# EAGLE design scheda_trasduttori_v2 (EAGLE 6.5.0)

## Sheet 1 of 4
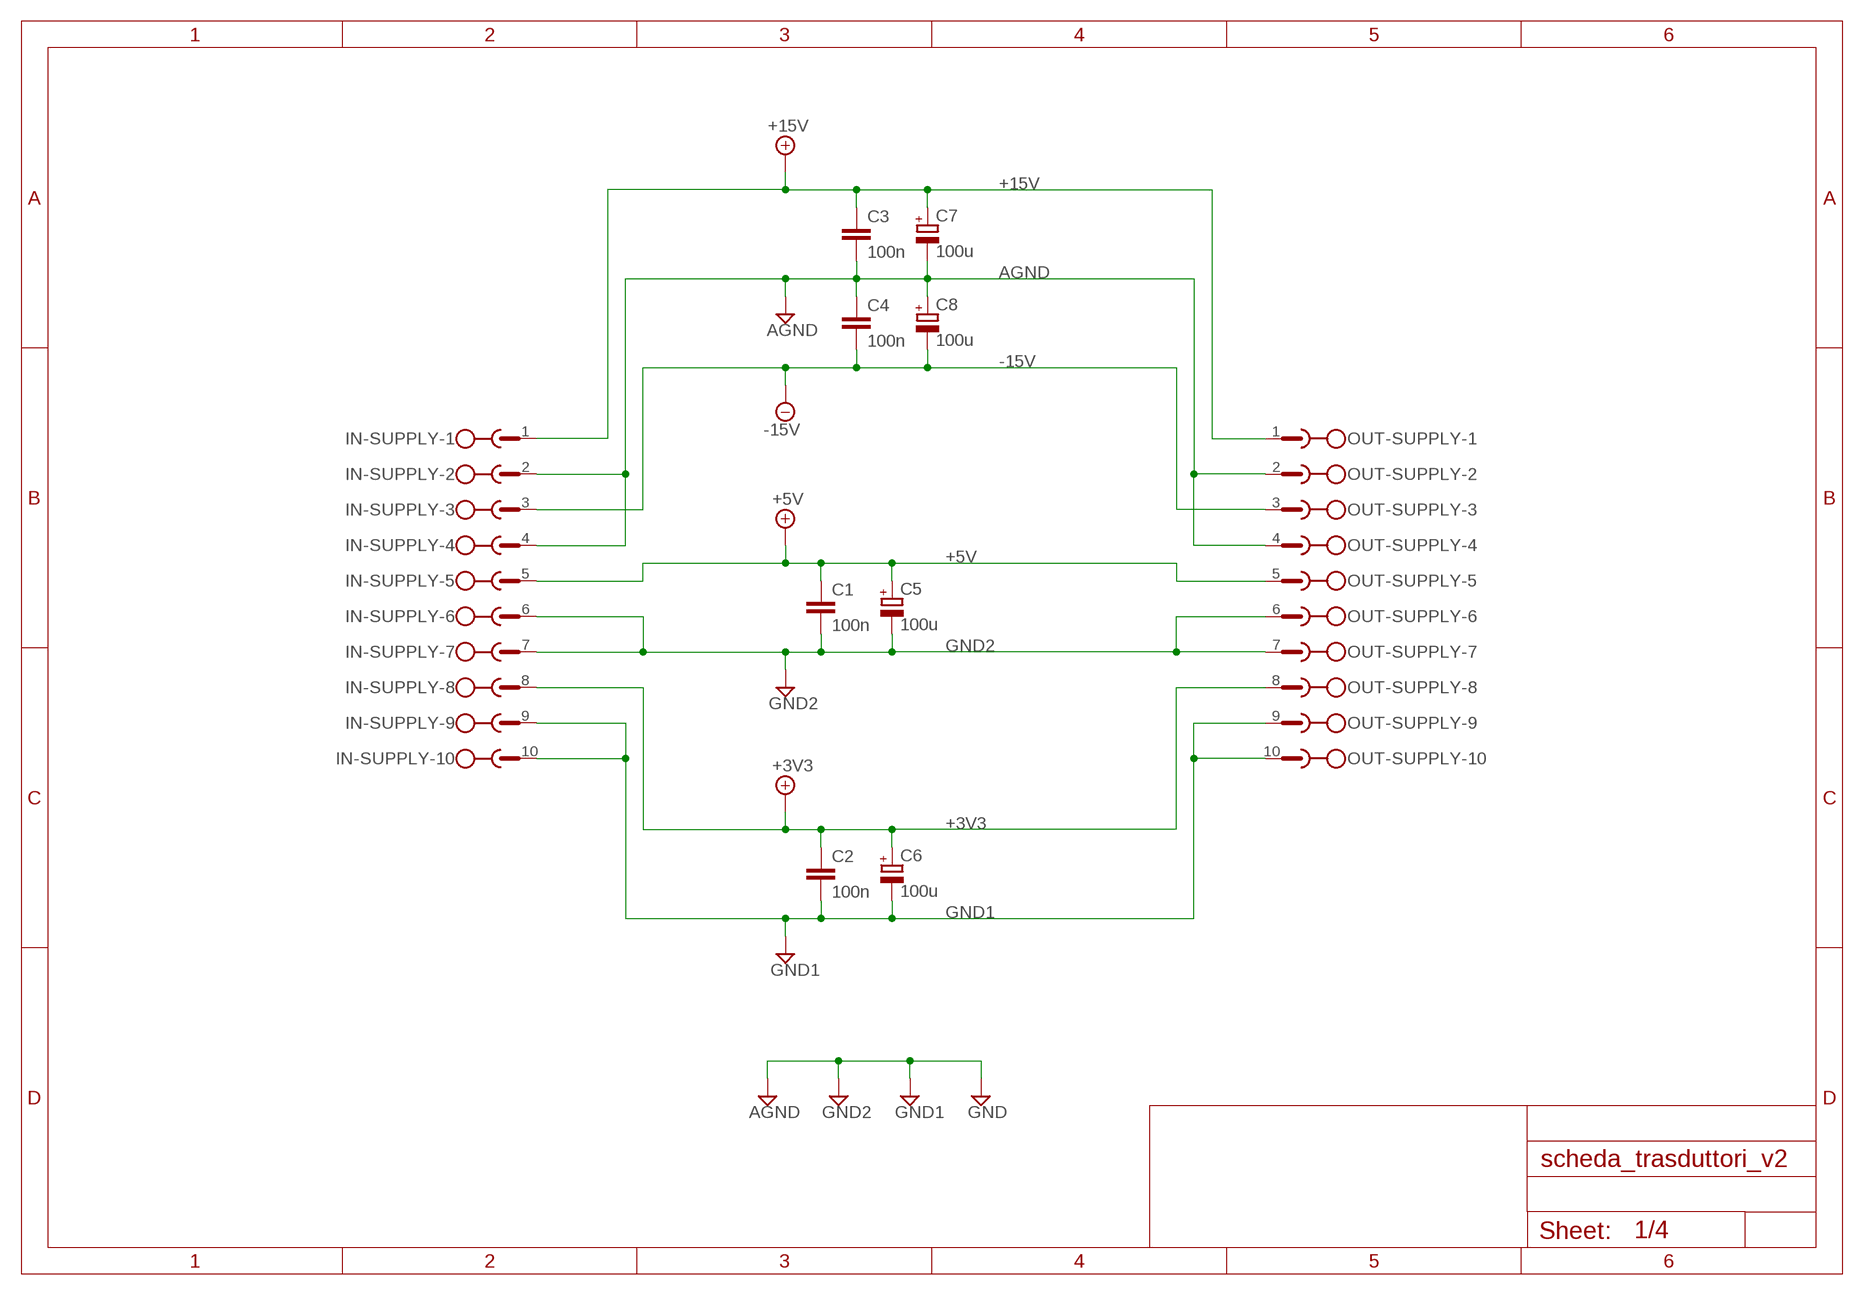
[diagram p0: schematic, sheet 1]

### Parts
C1  100n  C2,5-3  [C2.5-3]
C2  100n  C2,5-3  [C2.5-3]
C3  100n  C2,5-3  [C2.5-3]
C4  100n  C2,5-3  [C2.5-3]
C5  100u  CPOL-EUE2.5-7  [E2,5-7]
C6  100u  CPOL-EUE2.5-7  [E2,5-7]
C7  100u  CPOL-EUE2.5-7  [E2,5-7]
C8  100u  CPOL-EUE2.5-7  [E2,5-7]
IN-SUPPLY  MSTBA10  [MSTBA10]
OUT-SUPPLY  MSTBA10  [MSTBA10]

### Nets
+3V3: C2.1 C6.+ IN-SUPPLY.8 OUT-SUPPLY.8
+5V: C1.1 C5.+ IN-SUPPLY.5 OUT-SUPPLY.5 ; also sheet 2,4
+15V: C3.1 C7.+ IN-SUPPLY.1 OUT-SUPPLY.1 ; also sheet 2,3,4
-15V: C4.2 C8.- IN-SUPPLY.3 OUT-SUPPLY.3 ; also sheet 2,3,4
AGND: C3.2 C4.1 C7.- C8.+ IN-SUPPLY.2 IN-SUPPLY.4 OUT-SUPPLY.2 OUT-SUPPLY.4 ; also sheet 2,3,4
GND1: C2.2 C6.- IN-SUPPLY.9 IN-SUPPLY.10 OUT-SUPPLY.9 OUT-SUPPLY.10 ; also sheet 2,3
GND2: C1.2 C5.- IN-SUPPLY.6 IN-SUPPLY.7 OUT-SUPPLY.6 OUT-SUPPLY.7 ; also sheet 2,4

## Sheet 2 of 4
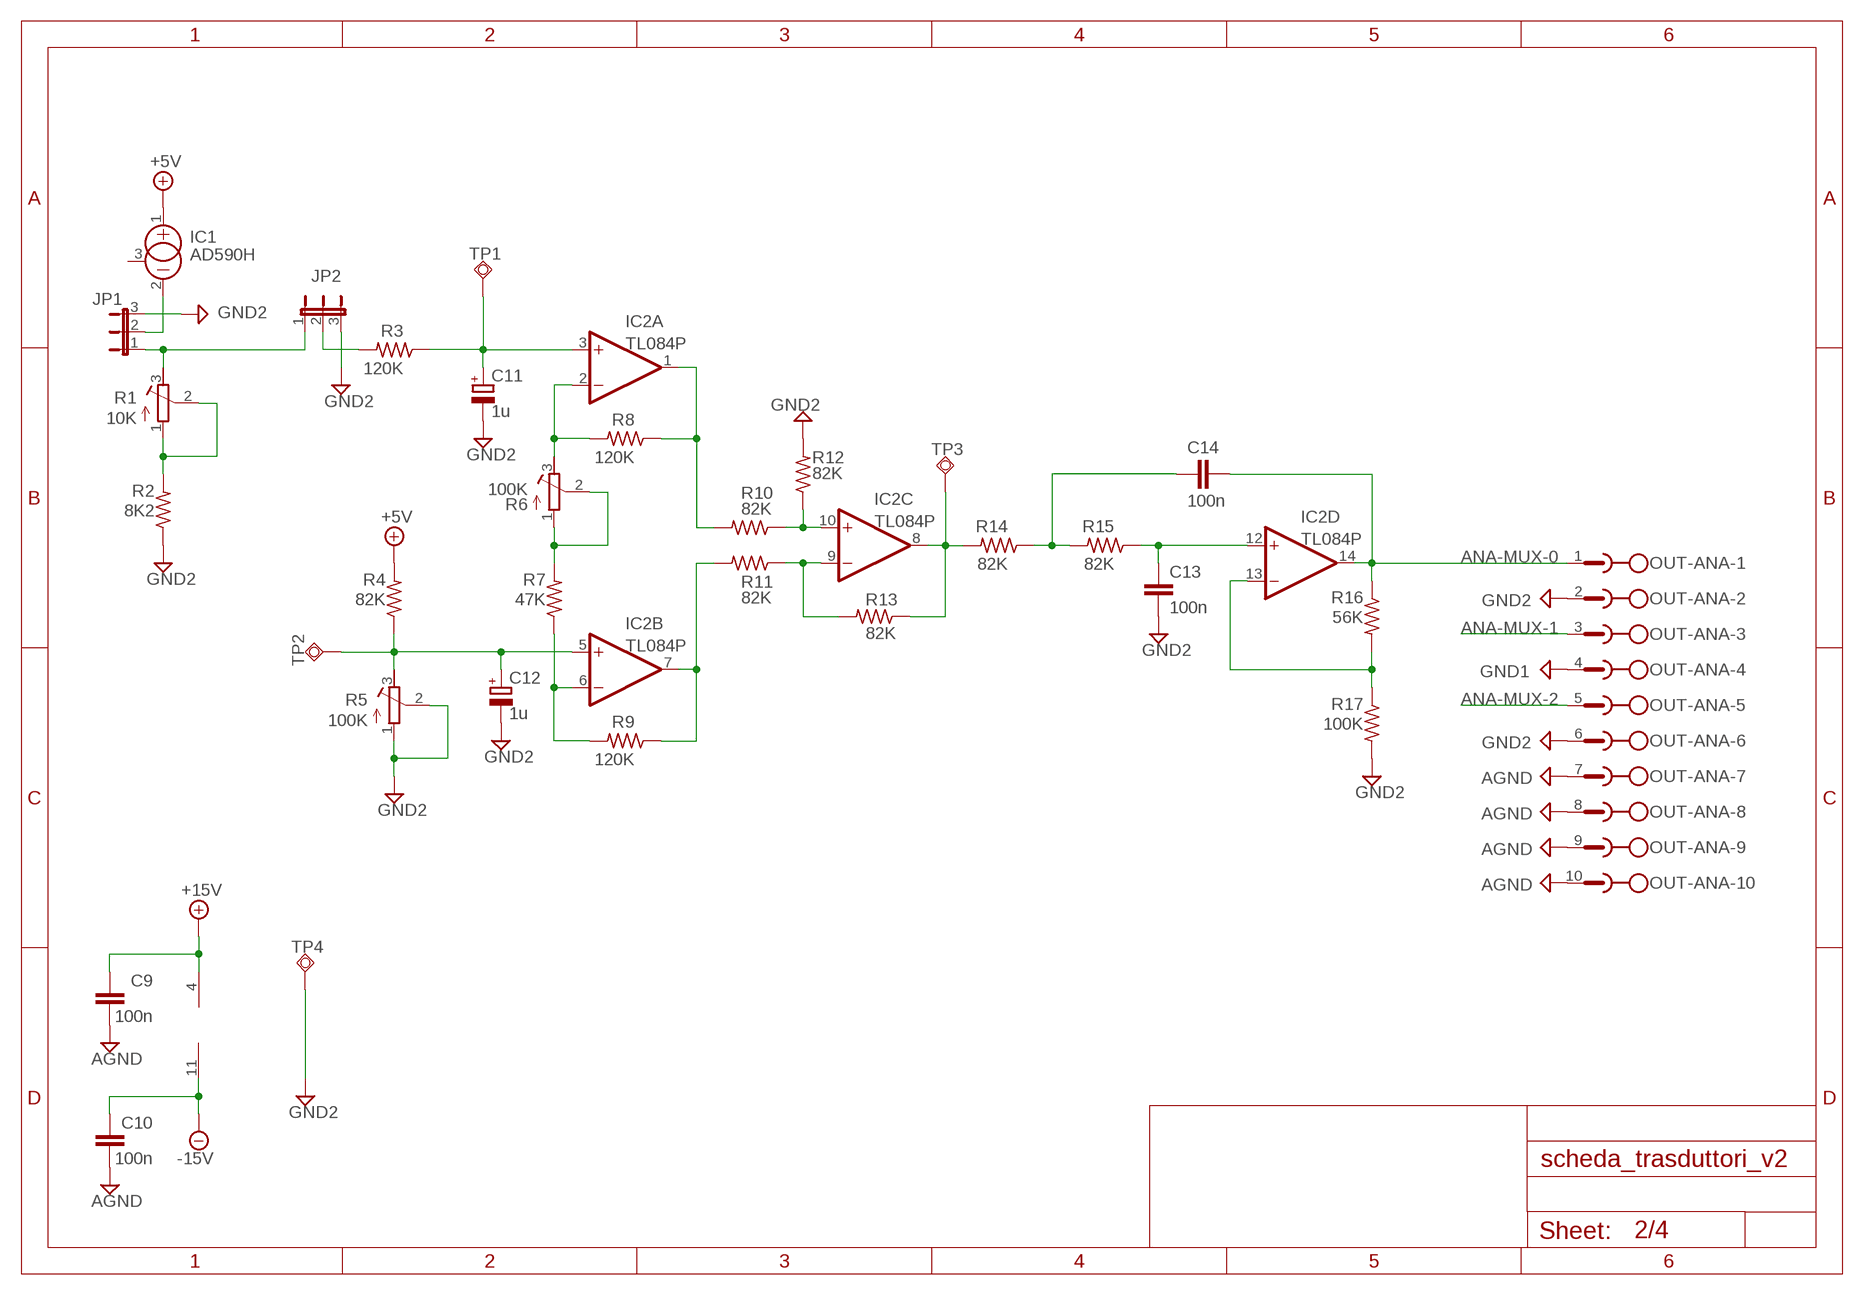
[diagram p1: schematic, sheet 2]

### Parts
C9  100n  C-EU025-024X044  [C025-024X044]
C10  100n  C-EU025-024X044  [C025-024X044]
C11  1u  CPOL-EUE5-8.5  [E5-8,5]
C12  1u  CPOL-EUE5-8.5  [E5-8,5]
C13  100n  C-EU025-024X044  [C025-024X044]
C14  100n  C-EU025-024X044  [C025-024X044]
IC1  AD590H  [TO18]
IC2  TL084P  [DIL14]
JP1  JP2E  [JP2]
JP2  JP2E  [JP2]
OUT-ANA  MSTBA10  [MSTBA10]
R1  10K  R-TRIMM64W  [RTRIM64W]
R2  8K2  R-US_0204/7  [0204/7]
R3  120K  R-US_0204/7  [0204/7]
R4  82K  R-US_0204/7  [0204/7]
R5  100K  R-TRIMM64W  [RTRIM64W]
R6  100K  R-TRIMM64W  [RTRIM64W]
R7  47K  R-US_0204/7  [0204/7]
R8  120K  R-US_0204/7  [0204/7]
R9  120K  R-US_0204/7  [0204/7]
R10  82K  R-US_0204/7  [0204/7]
R11  82K  R-US_0204/7  [0204/7]
R12  82K  R-US_0204/7  [0204/7]
R13  82K  R-US_0204/7  [0204/7]
R14  82K  R-US_0204/7  [0204/7]
R15  82K  R-US_0204/7  [0204/7]
R16  56K  R-US_0204/7  [0204/7]
R17  100K  R-US_0204/7  [0204/7]
TP1  TPSQPAD1-17Y  [P1-17Y]
TP2  TPSQPAD1-17Y  [P1-17Y]
TP3  TPSQPAD1-17Y  [P1-17Y]
TP4  TPSQPAD1-17Y  [P1-17Y]

### Nets
+5V: IC1.1(+) R4.2 ; also sheet 1,4
+15V: C9.2 IC2.4(P:V+) ; also sheet 1,3,4
-15V: C10.2 IC2.11(P:V-) ; also sheet 1,3,4
AGND: C9.1 C10.1 OUT-ANA.7 OUT-ANA.8 OUT-ANA.9 OUT-ANA.10 ; also sheet 1,3,4
ANA-MUX-0: C14.2 IC2.14(D:OUT) OUT-ANA.1 R16.1
ANA-MUX-1: OUT-ANA.3 ; also sheet 3
ANA-MUX-2: OUT-ANA.5 ; also sheet 4
GND1: OUT-ANA.4 ; also sheet 1,3
GND2: C11.- C12.- C13.1 JP1.3 JP2.3 OUT-ANA.2 OUT-ANA.6 R2.1 R5.1(E) R5.2(S) R12.2 R17.2 TP4.TP ; also sheet 1,4
N$1: R1.1(E) R1.2(S) R2.2
N$2: IC1.2(-) JP1.2
N$3: R6.1(E) R6.2(S) R7.2
N$4: C11.+ IC2.3(A:+IN) R3.1 TP1.TP
N$5: IC2.2(A:-IN) R6.3(A) R8.2
N$6: IC2.1(A:OUT) R8.1 R10.2
N$7: JP2.2 R3.2
N$8: JP1.1 JP2.1 R1.3(A)
N$9: C12.+ IC2.5(B:+IN) R4.1 R5.3(A) TP2.TP
N$10: IC2.6(B:-IN) R7.1 R9.2
N$11: IC2.7(B:OUT) R9.1 R11.2
N$12: IC2.10(C:+IN) R10.1 R12.1
N$13: IC2.9(C:-IN) R11.1 R13.2
N$14: IC2.8(C:OUT) R13.1 R14.2 TP3.TP
N$16: C14.1 R14.1 R15.2
N$17: C13.2 IC2.12(D:+IN) R15.1
N$18: IC2.13(D:-IN) R16.2 R17.1
Unconnected: IC1.3(CAN)

## Sheet 3 of 4
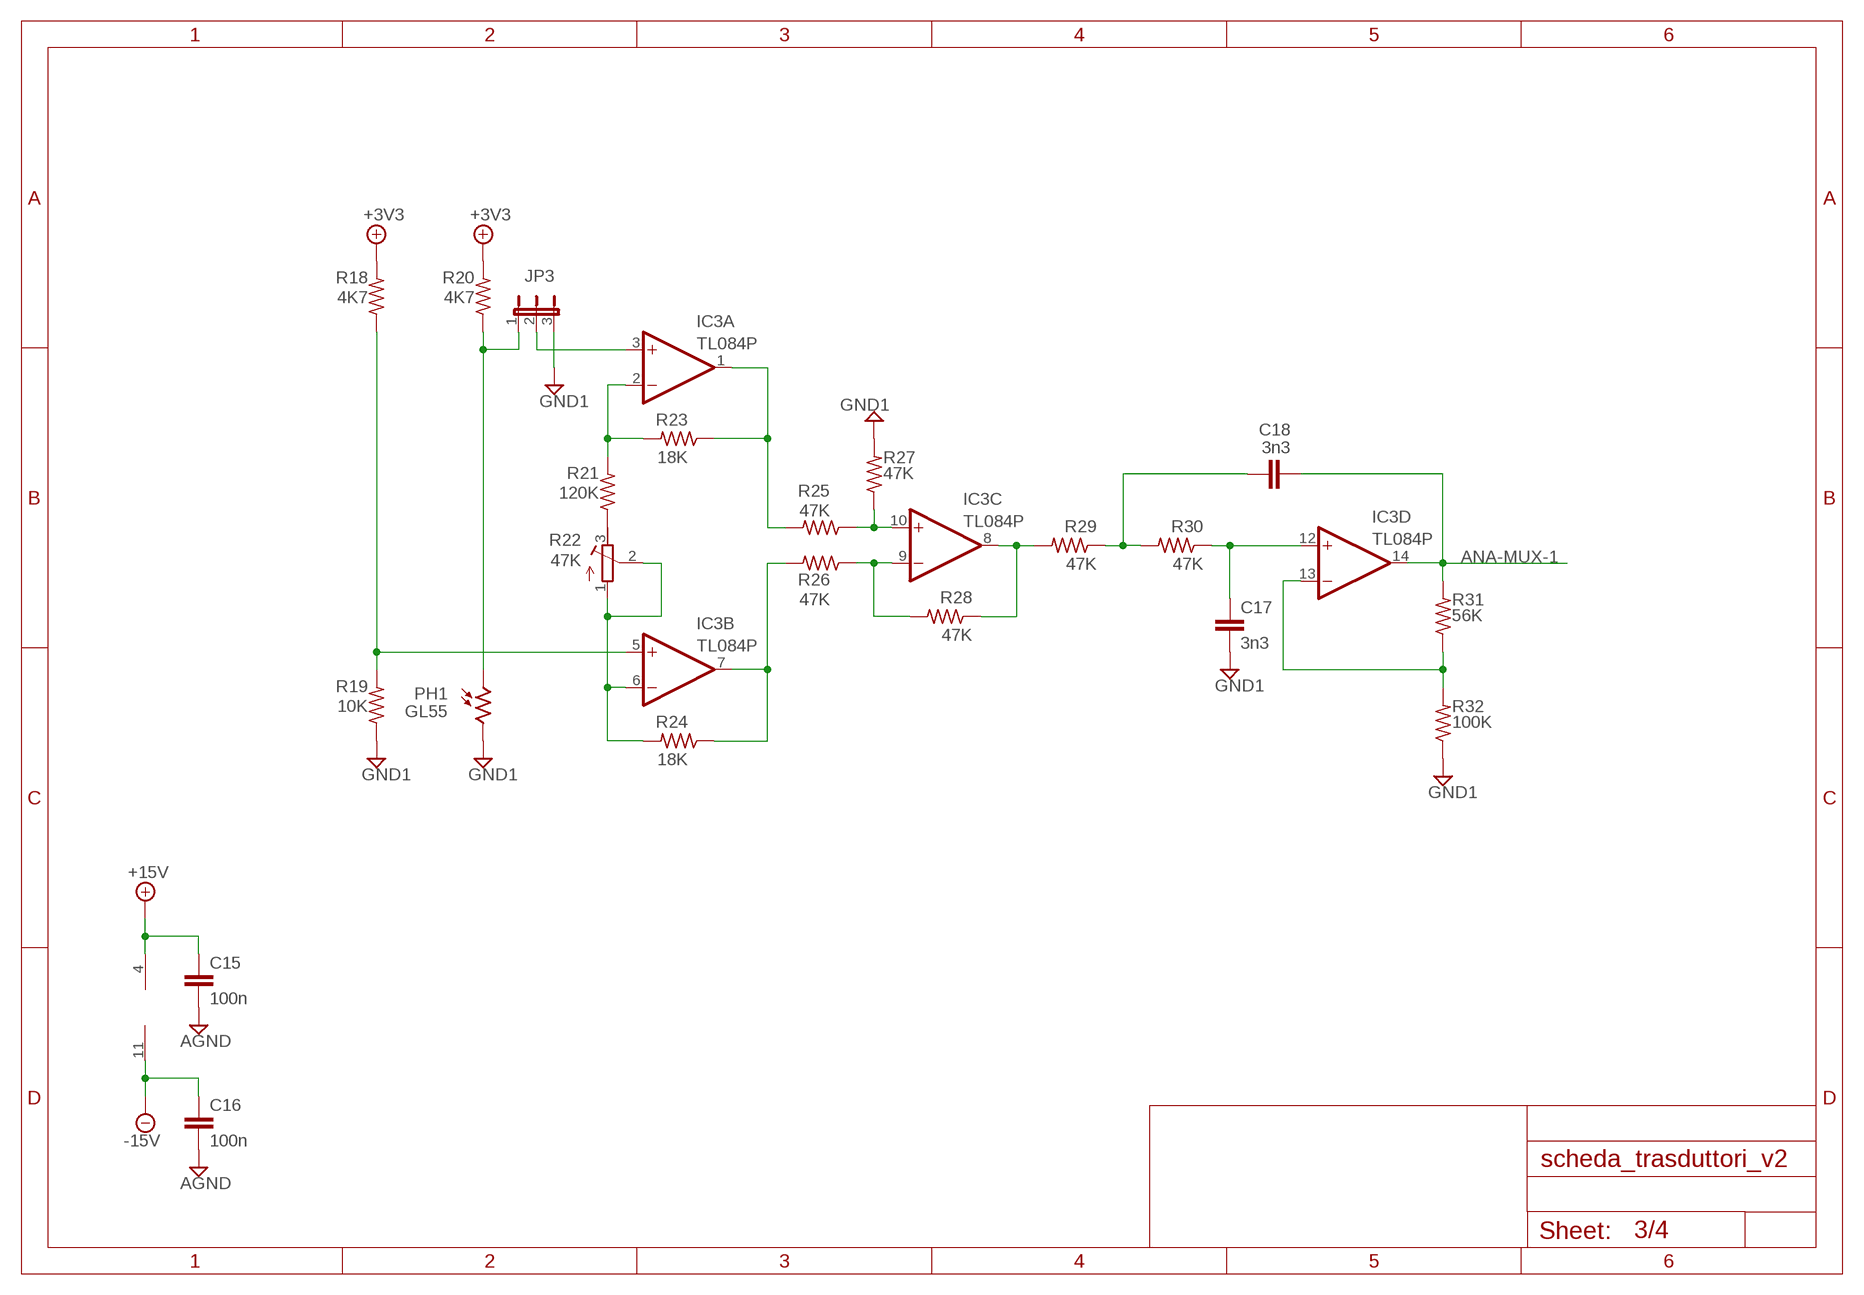
[diagram p2: schematic, sheet 3]

### Parts
C15  100n  C-EU025-025X050  [C025-025X050]
C16  100n  C-EU025-025X050  [C025-025X050]
C17  3n3  C-EU025-025X050  [C025-025X050]
C18  3n3  C-EU025-025X050  [C025-025X050]
IC3  TL084P  [DIL14]
JP3  JP2E  [JP2]
PH1  GL55  A1050_09  [T0-46-A10XX]
R18  4K7  R-US_0204/7  [0204/7]
R19  10K  R-US_0204/7  [0204/7]
R20  4K7  R-US_0204/7  [0204/7]
R21  120K  R-US_0204/7  [0204/7]
R22  47K  R-TRIMM64W  [RTRIM64W]
R23  18K  R-US_0204/7  [0204/7]
R24  18K  R-US_0204/7  [0204/7]
R25  47K  R-US_0204/7  [0204/7]
R26  47K  R-US_0204/7  [0204/7]
R27  47K  R-US_0204/7  [0204/7]
R28  47K  R-US_0204/7  [0204/7]
R29  47K  R-US_0204/7  [0204/7]
R30  47K  R-US_0204/7  [0204/7]
R31  56K  R-US_0204/7  [0204/7]
R32  100K  R-US_0204/7  [0204/7]

### Nets
+4.1V: R18.2 R20.2 ; supply symbol labelled +3V3
+15V: C15.1 IC3.4(P:V+) ; also sheet 1,2,4
-15V: C16.1 IC3.11(P:V-) ; also sheet 1,2,4
AGND: C15.2 C16.2 ; also sheet 1,2,4
ANA-MUX-1: C18.2 IC3.14(D:OUT) R31.2 ; also sheet 2
GND1: C17.2 JP3.3 PH1.2 R19.1 R27.2 R32.1 ; also sheet 1,2
N$15: IC3.5(B:+IN) R18.1 R19.2
N$19: JP3.1 PH1.1 R20.1
N$20: R21.1 R22.3(A)
N$21: IC3.6(B:-IN) R22.1(E) R22.2(S) R24.2
N$22: IC3.7(B:OUT) R24.1 R26.2
N$23: IC3.1(A:OUT) R23.1 R25.2
N$24: IC3.2(A:-IN) R21.2 R23.2
N$25: IC3.10(C:+IN) R25.1 R27.1
N$26: IC3.9(C:-IN) R26.1 R28.2
N$27: IC3.8(C:OUT) R28.1 R29.2
N$28: C17.1 IC3.12(D:+IN) R30.1
N$29: IC3.13(D:-IN) R31.1 R32.2
N$30: C18.1 R29.1 R30.2
N$31: IC3.3(A:+IN) JP3.2

## Sheet 4 of 4
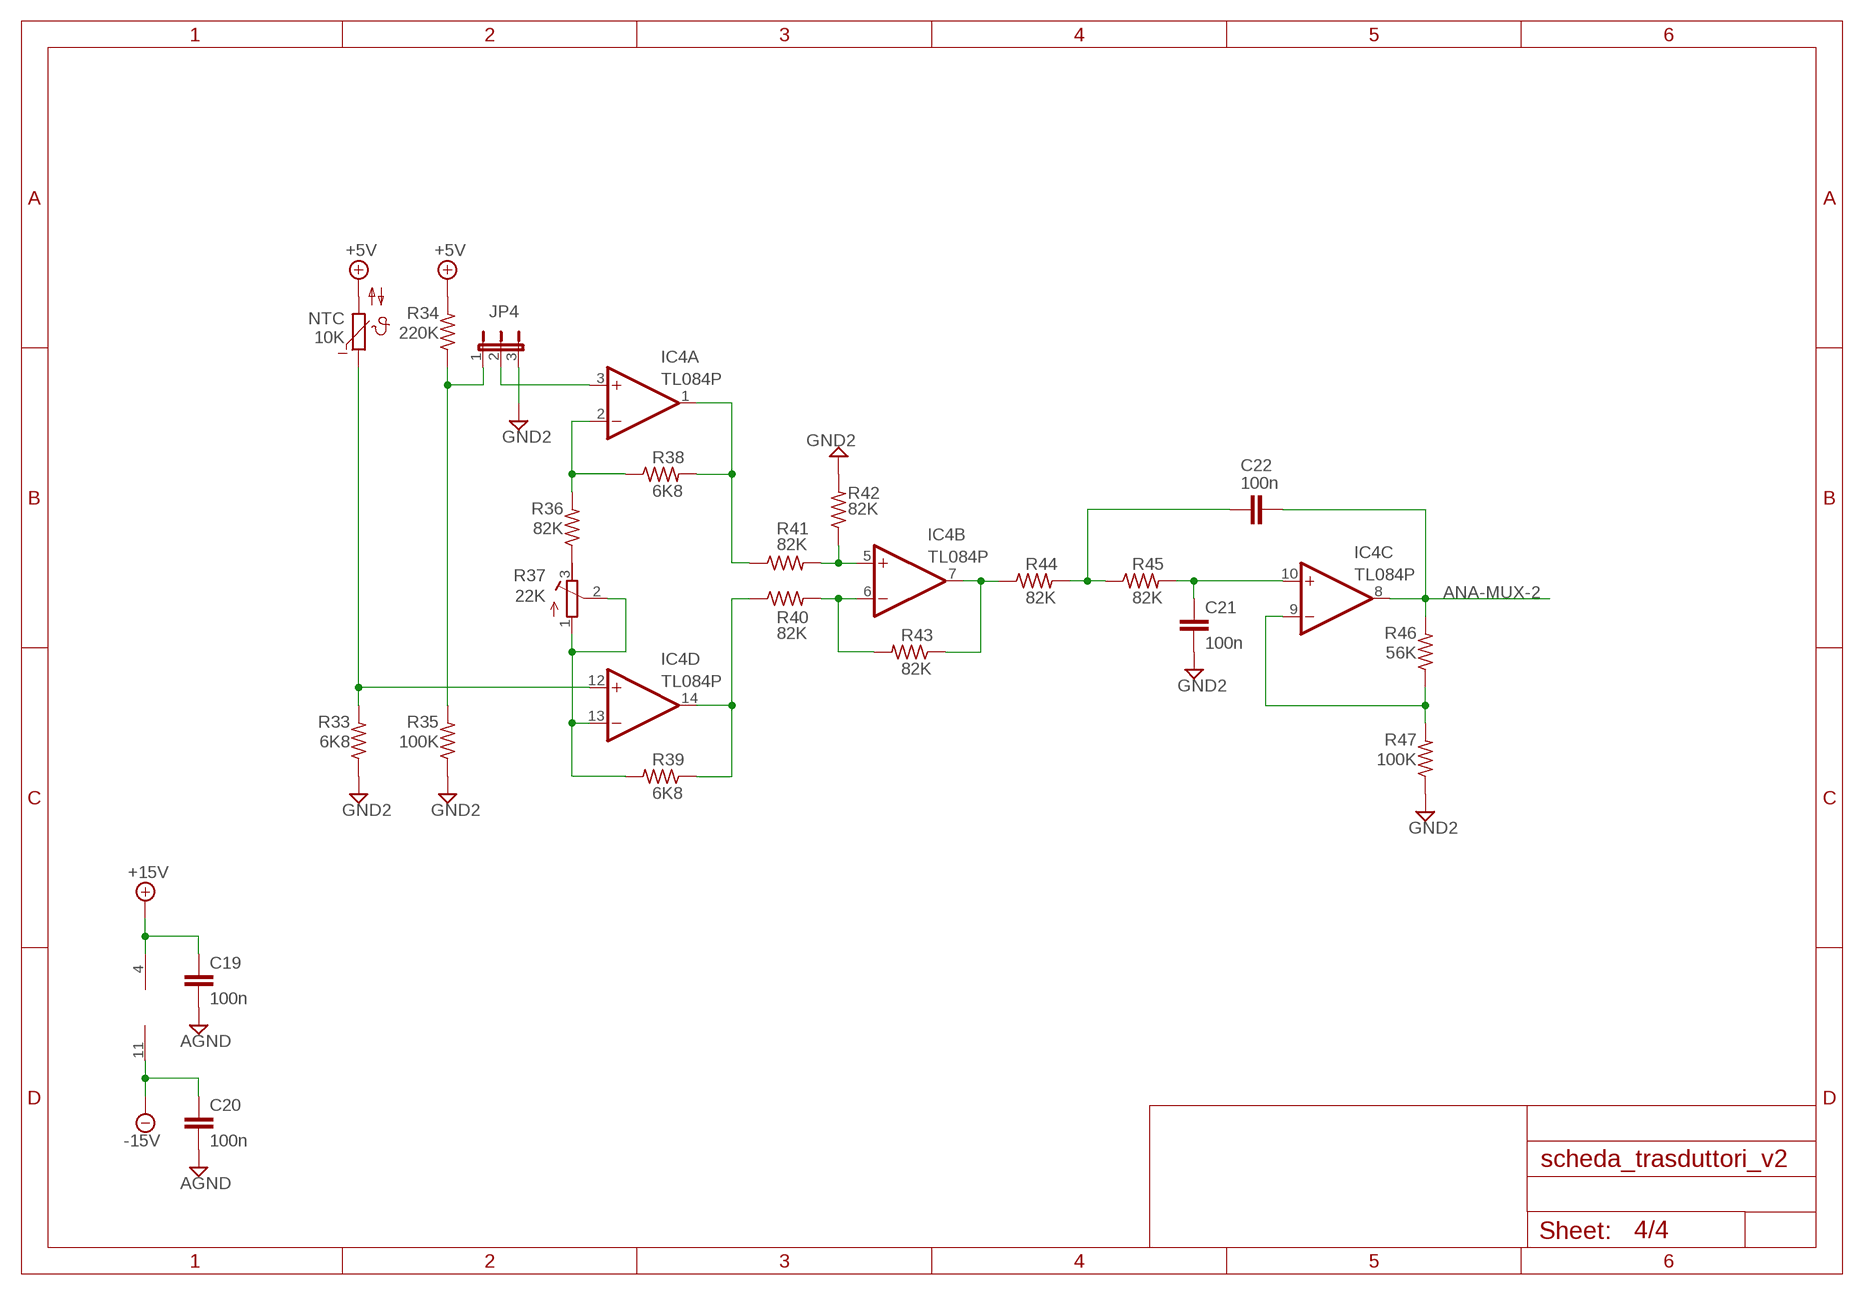
[diagram p3: schematic, sheet 4]

### Parts
C19  100n  C-EU025-025X050  [C025-025X050]
C20  100n  C-EU025-025X050  [C025-025X050]
C21  100n  C-EU025-025X050  [C025-025X050]
C22  100n  C-EU025-025X050  [C025-025X050]
IC4  TL084P  [DIL14]
JP4  JP2E  [JP2]
NTC  10K  NTC640  [P640]
R33  6K8  R-US_0204/7  [0204/7]
R34  220K  R-US_0204/7  [0204/7]
R35  100K  R-US_0204/7  [0204/7]
R36  82K  R-US_0204/7  [0204/7]
R37  22K  R-TRIMM64W  [RTRIM64W]
R38  6K8  R-US_0204/7  [0204/7]
R39  6K8  R-US_0204/7  [0204/7]
R40  82K  R-US_0204/7  [0204/7]
R41  82K  R-US_0204/7  [0204/7]
R42  82K  R-US_0204/7  [0204/7]
R43  82K  R-US_0204/7  [0204/7]
R44  82K  R-US_0204/7  [0204/7]
R45  82K  R-US_0204/7  [0204/7]
R46  56K  R-US_0204/7  [0204/7]
R47  100K  R-US_0204/7  [0204/7]

### Nets
+5V: NTC.2 R34.2 ; also sheet 1,2
+15V: C19.1 IC4.4(P:V+) ; also sheet 1,2,3
-15V: C20.1 IC4.11(P:V-) ; also sheet 1,2,3
AGND: C19.2 C20.2 ; also sheet 1,2,3
ANA-MUX-2: C22.2 IC4.8(C:OUT) R46.2 ; also sheet 2
GND2: C21.2 JP4.3 R33.1 R35.1 R42.2 R47.1 ; also sheet 1,2
N$32: C21.1 IC4.10(C:+IN) R45.2
N$33: IC4.9(C:-IN) R46.1 R47.2
N$34: C22.1 R44.2 R45.1
N$35: IC4.12(D:+IN) NTC.1 R33.2
N$36: R36.1 R37.3(A)
N$37: IC4.2(A:-IN) R36.2 R38.1
N$38: IC4.1(A:OUT) R38.2 R40.1
N$39: IC4.13(D:-IN) R37.1(E) R37.2(S) R39.2
N$40: IC4.14(D:OUT) R39.1 R41.1
N$41: IC4.6(B:-IN) R41.2 R43.2
N$42: IC4.5(B:+IN) R40.2 R42.1
N$43: IC4.7(B:OUT) R43.1 R44.1
N$44: JP4.1 R34.1 R35.2
N$45: IC4.3(A:+IN) JP4.2

## Library data of the parts
C1-C4 = capacitor-wima:C: CAPACITOR naming: grid - package width
C5-C8 C11 C12 = rcl:CPOL-EU: POLARIZED CAPACITOR, European symbol
C9 C10 C13-C22 = rcl:C-EU: CAPACITOR, European symbol
IC1 = linear:AD590H: TEMPERATURE SENSOR current output
IC2-IC4 = linear:TL084: OP AMP
IN-SUPPLY OUT-ANA OUT-SUPPLY = ITIS:MSTBA10
JP1-JP4 = jumper:JP2E: JUMPER
NTC = ptc-ntc:NTC640: PHILIPS NTC; OC_FARNELL: unknown; OC_NEWARK: unknown
PH1 = photo-elements:A10: Sensor Robust Light Sensing Applications Outdoor Light Sensing Application Source: http://optoelectronics.perkinelmer.com/content/Datasheets/DTS_PhotocellsA1050.pdf; TYPE: GL55
R1 R5 R6 R22 R37 = resistor:R-TRIMM: Trimm resistor
R2-R4 R7-R21 R23-R32 = rcl:R-US_: RESISTOR, American symbol
R33-R36 R38-R47 = resistor:R-US_: RESISTOR, American symbol
TP1-TP4 = testpad:TPSQ: Test pad

## Board
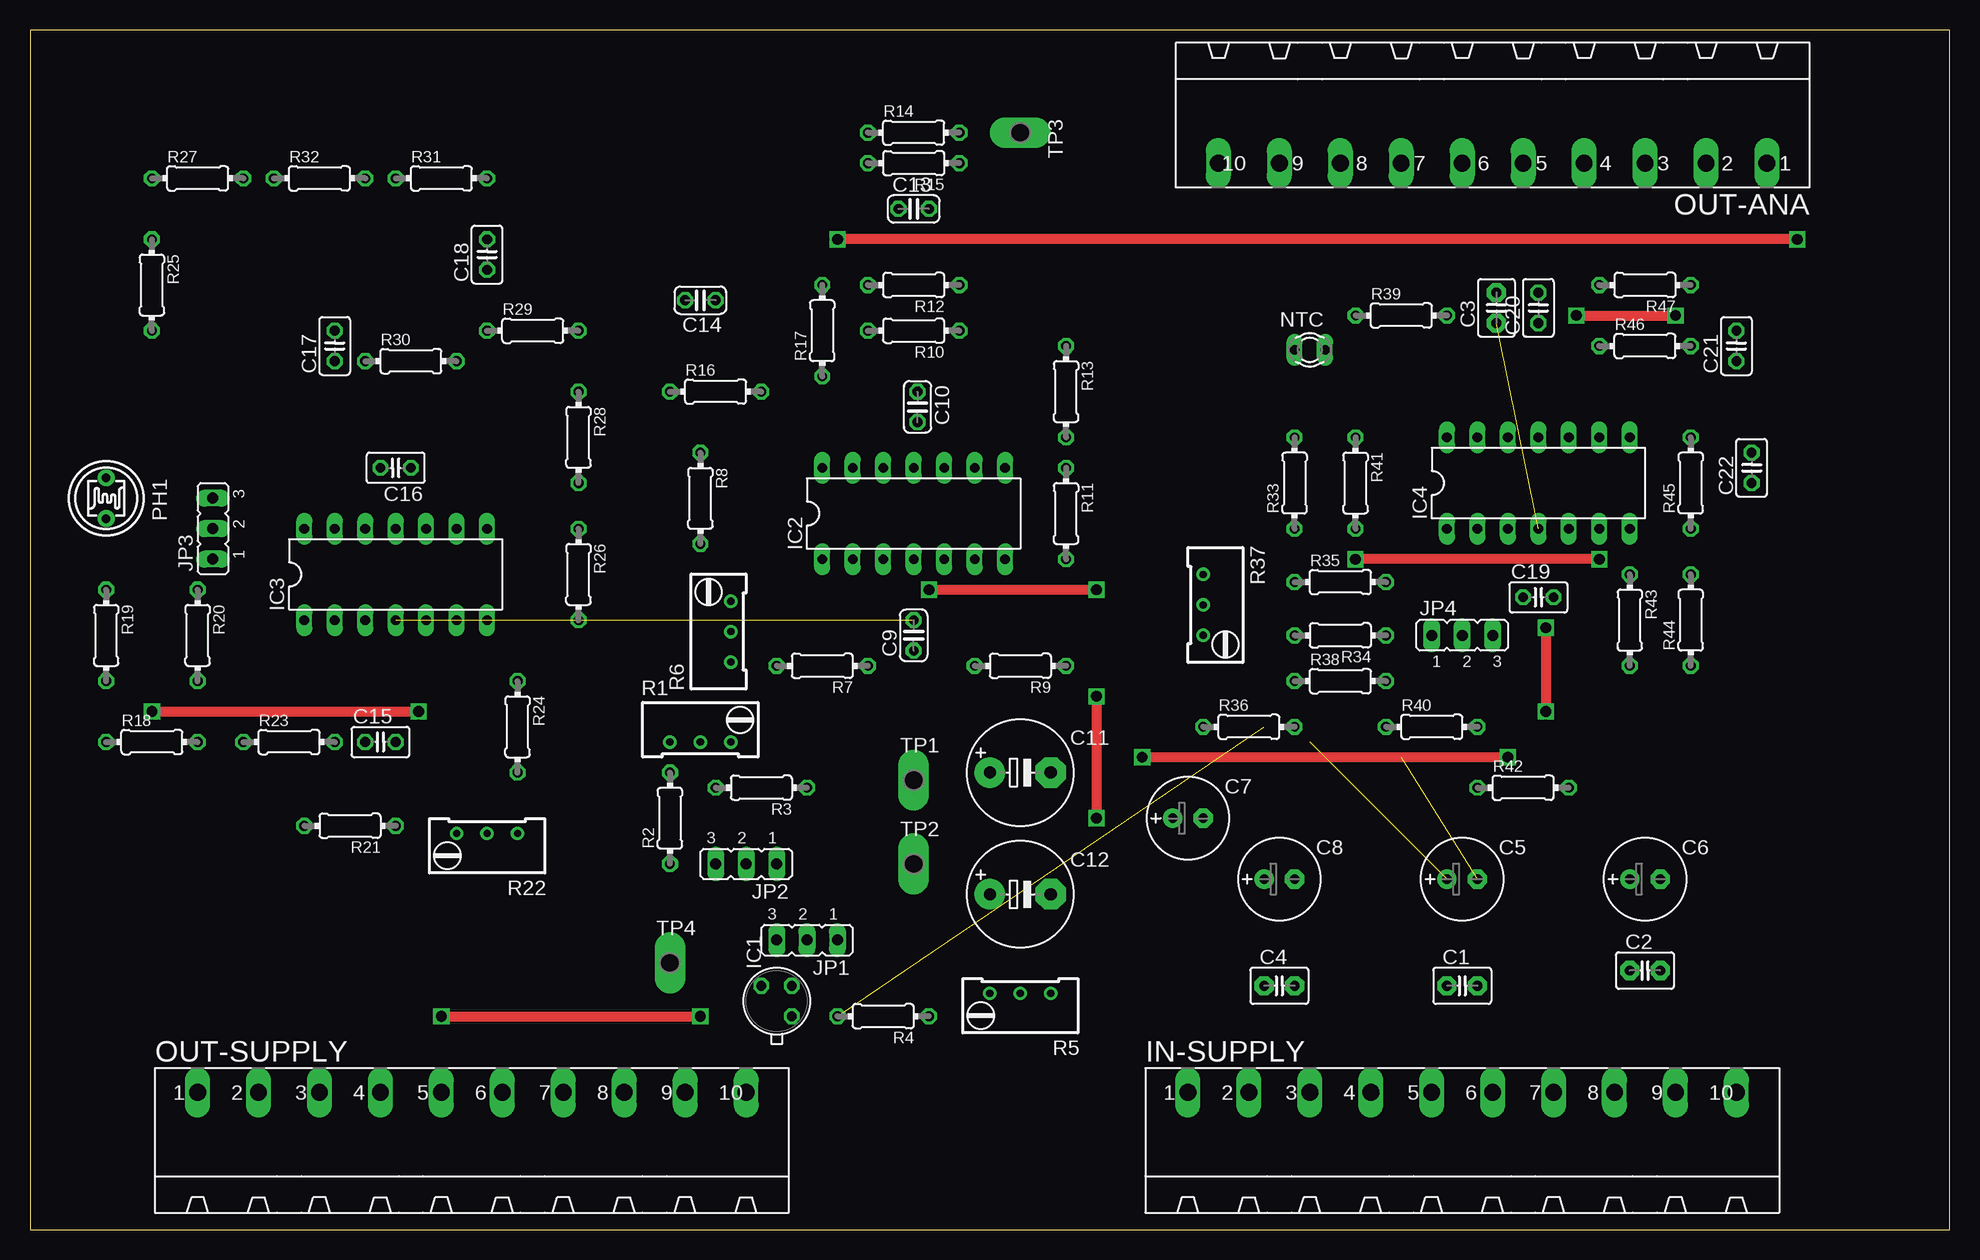
[diagram p4: board, top side]
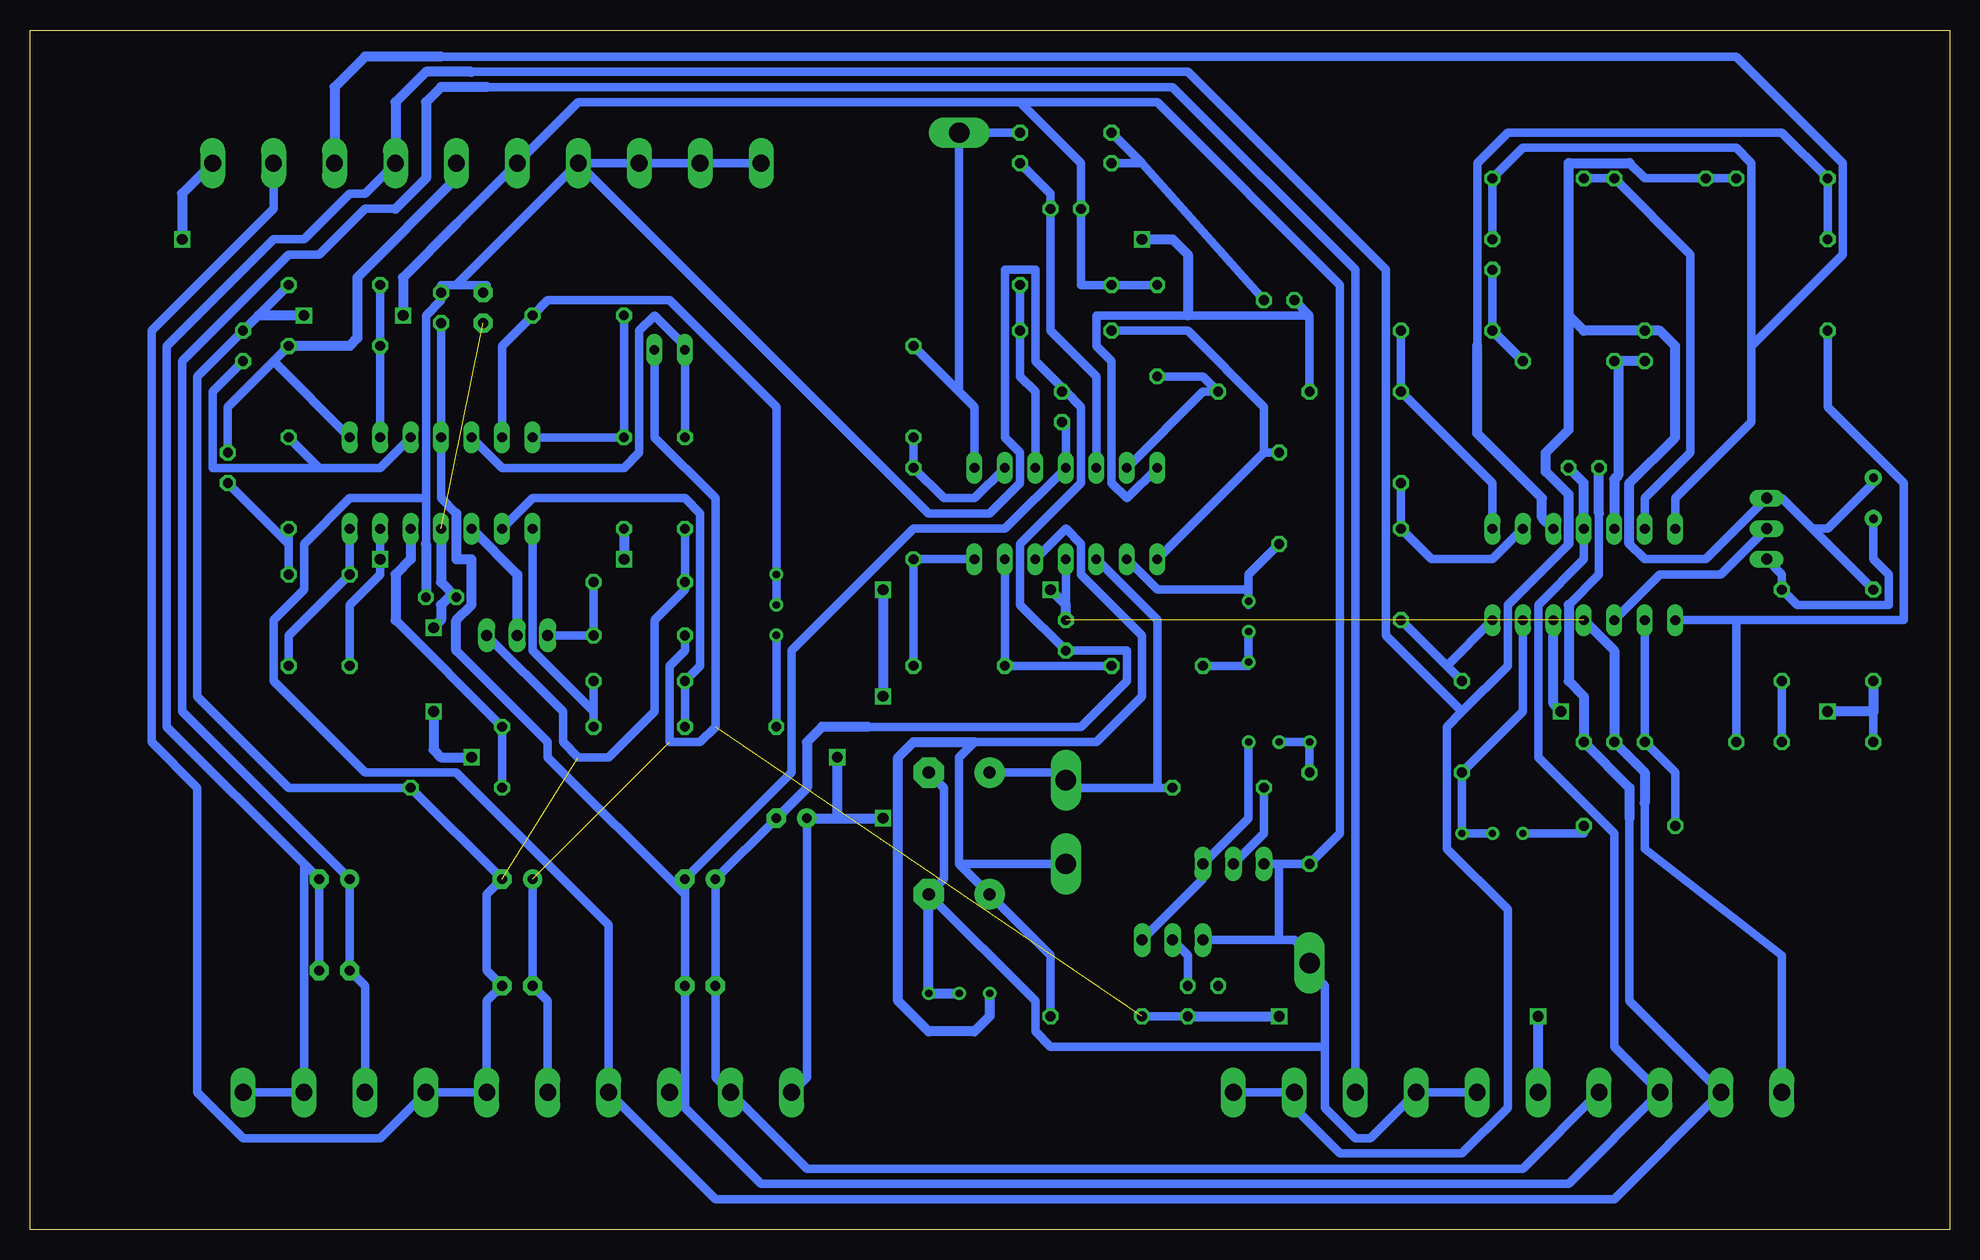
[diagram p5: board, bottom side, seen from below]

Size 160 x 100 mm. Coordinates in mm from the lower left corner, seen from the top.
Outline: 0,0 160,0 160,100 0,100 0,0
Copper layers (1*16): Top 0.035mm / dielectric 1.5mm / Bottom 0.035mm
Design rules "default *": minimum track width 28mil, minimum drill 24mil, track to track 8mil, track to pad 8mil, pad to pad 8mil, via to via 8mil, smd to smd 8mil, copper to edge 40mil, drill to drill 8mil, minimum pad ring 10mil, minimum via ring 8mil, stop-mask expansion 4mil, vias tented up to drill 0mil, thermal gap 10mil

### Footprints (pad centres in the part's own frame; a part is rotated, then mirrored left to right if it is on the bottom)
C2.5-3 = drill 0.813 pad 1.6 octagon: 1 -1.27,0; 2 1.27,0
E2,5-7 = drill 0.813 pad 1.6: + -1.27,0 | drill 0.813 pad 1.6 octagon: - 1.27,0
C025-024X044 = drill 0.813 octagon: 1 -1.27,0; 2 1.27,0
E5-8,5 = drill 1.016 pad 2.54: + -2.54,0 | drill 1.016 pad 2.54 octagon: - 2.54,0
C025-025X050 = drill 0.813 octagon: 1 -1.27,0; 2 1.27,0
TO18 = drill 0.813 octagon: 1 -1.27,-1.27; 2 1.27,-1.27; 3 1.27,1.27
DIL14 = drill 0.813 long: 1 -7.62,-3.81; 2 -5.08,-3.81; 3 -2.54,-3.81; 4 0,-3.81; 5 2.54,-3.81; 6 5.08,-3.81; 7 7.62,-3.81; 8 7.62,3.81; 9 5.08,3.81; 10 2.54,3.81; 11 0,3.81; 12 -2.54,3.81; 13 -5.08,3.81; 14 -7.62,3.81
MSTBA10 = drill 1.397 long: 1 -22.86,5.08; 2 -17.78,5.08; 3 -12.7,5.08; 4 -7.62,5.08; 5 -2.54,5.08; 6 2.54,5.08; 7 7.62,5.08; 8 12.7,5.08; 9 17.78,5.08; 10 22.86,5.08
JP2 = drill 0.914 long: 1 -2.54,0; 2 0,0; 3 2.54,0
P640 = drill 0.813 long: 1 -1.27,0; 2 1.27,0
T0-46-A10XX = drill 0.7 pad 1.4: 1 -1.7,0; 2 1.7,0
RTRIM64W = drill 0.61: 1 1.27,-2.54; 2 1.27,0; 3 1.27,2.54
0204/7 = drill 0.813 octagon: 1 -3.81,0; 2 3.81,0
P1-17Y = drill 1.702 pad 2.121 long: TP 0,0

### Placement (x,y rotation side)
C1  119.38,20.32 0 top
C2  134.62,21.59 0 top
C3  122.24,76.83 90 top
C4  104.14,20.32 0 top
C5  119.38,29.21 0 top
C6  134.62,29.21 0 top
C7  96.52,34.29 0 top
C8  104.14,29.21 0 top
C9  73.66,49.53 90 top
C10  73.98,68.58 270 top
C11  82.55,38.1 0 top
C12  82.55,27.94 0 top
C13  73.66,85.09 0 top
C14  55.88,77.47 180 top
C15  29.21,40.64 0 top
C16  30.48,63.5 180 top
C17  25.4,73.66 90 top
C18  38.1,81.28 90 top
C19  125.73,52.7 0 top
C20  125.73,76.83 90 top
C21  142.24,73.66 90 top
C22  143.51,63.5 90 top
IC1  62.23,19.05 90 top
IC2  73.66,59.69 0 top
IC3  30.48,54.61 0 top
IC4  125.73,62.23 0 top
IN-SUPPLY  119.38,6.35 0 top
JP1  64.77,24.13 180 top
JP2  59.69,30.48 180 top
JP3  15.24,58.42 90 top
JP4  119.38,49.53 0 top
NTC  106.68,73.34 0 top
OUT-ANA  121.92,93.98 180 top
OUT-SUPPLY  36.83,6.35 0 top
PH1  6.35,60.96 90 top
R1  55.88,41.91 270 top
R2  53.34,34.29 90 top
R3  60.96,36.83 180 top
R4  71.12,17.78 180 top
R5  82.55,18.41 90 top
R6  57.15,49.85 0 top
R7  66.04,46.99 180 top
R8  55.88,60.96 270 top
R9  82.55,46.99 180 top
R10  73.66,74.93 180 top
R11  86.36,59.69 270 top
R12  73.66,78.74 180 top
R13  86.36,69.85 270 top
R14  73.66,91.44 0 top
R15  73.66,88.9 180 top
R16  57.15,69.85 0 top
R17  66.04,74.93 90 top
R18  10.16,40.64 0 top
R19  6.35,49.53 270 top
R20  13.97,49.53 270 top
R21  26.67,33.66 180 top
R22  38.1,31.75 90 top
R23  21.59,40.64 0 top
R24  40.64,41.91 270 top
R25  10.16,78.74 270 top
R26  45.72,54.61 270 top
R27  13.97,87.63 0 top
R28  45.72,66.04 270 top
R29  41.91,74.93 0 top
R30  31.75,72.39 0 top
R31  34.29,87.63 0 top
R32  24.13,87.63 0 top
R33  105.41,62.23 90 top
R34  109.22,49.53 180 top
R35  109.22,53.98 0 top
R36  101.6,41.91 0 top
R37  99.06,52.07 180 top
R38  109.22,45.72 0 top
R39  114.3,76.2 0 top
R40  116.84,41.91 0 top
R41  110.49,62.23 270 top
R42  124.46,36.83 0 top
R43  133.35,50.8 270 top
R44  138.43,50.8 90 top
R45  138.43,62.23 90 top
R46  134.62,73.66 0 top
R47  134.62,78.74 180 top
TP1  73.66,37.47 0 top
TP2  73.66,30.48 0 top
TP3  82.55,91.44 270 top
TP4  53.34,22.23 0 top

### Tracks (layer width: path | path; a pad name or v marks a point on that pad's centre or on a via)
+3V3
  Bottom 0.711: OUT-SUPPLY.8 49.53,80.01 64.77,95.25 121.92,95.25 | 129.54,85.09 132.08,85.09 135.89,81.28 138.43,81.28 147.32,72.39 147.32,43.18 C6.+ C2.1 132.08,20.32 IN-SUPPLY.8
  Bottom 0.813: 121.92,95.25 125.73,95.25 127,93.98 127,87.63 129.54,85.09
+4.1V
  Bottom 0.711: R20.2 R18.2
+5V  (via drill 0.6 pad 0.81, 0.9 pad 0.81)  (2 unrouted)
  Top 0.813: v34.29,17.78 v55.88,17.78
  Bottom 0.711: C5.+ C1.1 116.84,19.05 IN-SUPPLY.5 | R34.2 105.41,48.26 106.68,46.99 106.68,40.64 104.14,40.64 102.87,41.91 102.87,60.96 107.95,66.04 NTC.2 | R4.2 IC1.1
  Bottom 0.813: OUT-SUPPLY.5 v34.29,17.78 | IC1.1 v55.88,17.78
+15V  (via drill 0.9 pad 0.81)  (2 unrouted)
  Top 0.813: v126.36,50.16 v126.36,43.18 | v123.19,39.37 v92.71,39.37 | v74.93,53.34 v88.9,53.34 | v88.9,44.45 v88.9,34.29
  Bottom 0.711: OUT-SUPPLY.1 13.97,22.86 25.4,31.75 25.4,35.56 | IC2.4 73.66,52.07 | C7.+ 95.25,12.7 IN-SUPPLY.1
  Bottom 0.813: C7.+ 92.71,34.29 | IC3.4 27.94,48.26 C15.1 25.4,38.1 25.4,35.56 | IC4.4 125.73,53.98 C19.1 125.09,52.7 125.73,52.07 125.73,50.8 v126.36,50.16 | v126.36,43.18 126.36,40.01 125.73,39.37 v123.19,39.37 | v92.71,39.37 92.71,34.29 | C9.2 73.66,52.07 v74.93,53.34 | v88.9,53.34 v88.9,44.45 | 92.71,34.29 v88.9,34.29
-15V
  Bottom 0.711: C20.1 IC4.11 125.73,60.96 124.46,59.69 | C10.2 73.66,67.31 IC2.11 78.74,58.42 86.36,58.42 96.52,48.26 96.52,38.1 C8.- 105.41,27.94 | 105.41,27.94 C4.2 105.41,10.16 | 124.46,48.26 116.84,40.64 116.84,39.37 105.41,27.94 | IN-SUPPLY.3 105.41,10.16 | 105.41,10.16 99.06,3.81 31.75,3.81 OUT-SUPPLY.3 27.94,15.24 27.94,33.02 34.29,39.37 34.29,52.07 30.48,55.88 IC3.11
  Bottom 0.813: IC3.11 30.48,62.23 C16.1 | 124.46,59.69 124.46,55.88 123.19,55.88 123.19,52.07 124.46,50.8 124.46,48.26
AGND
  Bottom 0.711: 73.66,69.85 72.39,68.58 72.39,62.23 77.47,57.15 77.47,52.07 C9.1 68.58,48.26 68.58,45.72 72.39,41.91 90.17,41.91 | C7.- C8.+ C4.1 102.87,12.7 IN-SUPPLY.2 95.25,5.08 35.56,5.08 OUT-SUPPLY.4 | OUT-ANA.10 OUT-ANA.9 OUT-ANA.8 OUT-ANA.7 | 124.46,78.74 121.92,78.74 C3.2 | 124.46,78.74 125.73,78.74 C20.2 125.73,77.47 127,76.2 127,60.96 | 127,60.96 127,57.15 | 124.46,78.74 OUT-ANA.7 | 26.67,34.29 26.67,19.05 OUT-SUPPLY.2 27.94,2.54 102.87,2.54 IN-SUPPLY.4 111.76,25.4 124.46,38.1 132.08,38.1 139.7,45.72 139.7,50.8 137.16,53.34 137.16,57.15 133.35,60.96 127,60.96 | 29.21,59.69 29.21,54.61 31.75,52.07 | 73.66,69.85 76.2,72.39 76.2,80.01 78.74,80.01 78.74,66.04 77.47,64.77 77.47,62.23 80.01,59.69 85.09,59.69 OUT-ANA.7 | 73.66,69.85 C10.1
  Bottom 0.813: 31.75,52.07 31.75,45.72 30.48,44.45 C15.2 26.67,36.83 26.67,34.29 | 29.21,59.69 C16.2 | 127,57.15 C19.2 | 90.17,41.91 93.98,41.91 95.25,40.64 95.25,36.83 C7.-
ANA-MUX-0  (via drill 0.9 pad 0.81)
  Top 0.813: v147.32,82.55 v67.31,82.55
  Bottom 0.711: 53.34,76.2 R16.1 | C14.2 53.34,76.2 | IC2.14 68.58,60.96 69.85,62.23 69.85,72.39 71.12,73.66 71.12,76.2 63.5,76.2 53.34,76.2
  Bottom 0.813: OUT-ANA.1 147.32,86.36 v147.32,82.55 | v67.31,82.55 64.77,82.55 63.5,81.28 63.5,76.2
ANA-MUX-1
  Bottom 0.711: IC3.14 22.86,60.96 16.51,67.31 16.51,73.66 | 16.51,73.66 16.51,88.9 17.78,90.17 35.56,90.17 R31.2 C18.2 | 125.73,97.79 17.78,97.79 8.89,88.9 8.89,81.28 16.51,73.66
  Bottom 0.813: 125.73,97.79 132.08,97.79 134.62,95.25 OUT-ANA.3
ANA-MUX-2
  Bottom 0.711: C22.2 143.51,68.58 139.7,72.39 | R46.2 139.7,72.39 | 139.7,72.39 IC4.8
  Bottom 0.813: OUT-ANA.5 124.46,87.63 132.72,79.38 132.72,74.3 133.35,73.66 R46.2
GND1
  Bottom 0.711: IN-SUPPLY.10 IN-SUPPLY.9 137.16,30.48 | C2.2 C6.- 137.16,30.48 | 137.16,30.48 148.59,41.91 148.59,73.66 139.7,82.55 137.16,82.55 133.35,86.36 132.08,86.36 OUT-ANA.4 129.54,90.17 | OUT-SUPPLY.10 OUT-SUPPLY.9 54.61,10.16 50.8,6.35 40.64,6.35 36.83,10.16 36.83,26.67 41.91,31.75 41.91,41.91 40.64,43.18 | R27.2 R32.1 25.4,87.63 26.67,88.9 | 11.43,58.42 13.97,60.96 JP3.3 20.32,55.88 25.4,55.88 26.67,57.15 | 11.43,58.42 R19.1 | 11.43,58.42 10.16,58.42 6.35,62.23 PH1.2 | 40.64,43.18 36.83,46.99 36.83,52.07 31.75,57.15 | 123.19,96.52 63.5,96.52 46.99,80.01 46.99,49.53 40.64,43.18
  Bottom 0.813: 26.67,57.15 26.67,62.23 22.86,66.04 22.86,73.66 24.13,74.93 C17.2 30.48,74.93 31.75,76.2 | 31.75,76.2 31.75,88.9 26.67,88.9 | 31.75,57.15 31.75,61.28 33.66,63.18 33.66,64.77 31.75,66.67 31.75,76.2 | 123.19,96.52 127,96.52 129.54,93.98 129.54,90.17
GND2  (via drill 0.9 pad 0.81)  (1 unrouted)
  Top 0.813: v128.91,76.2 v137.16,76.2
  Bottom 0.711: OUT-ANA.2 139.7,85.09 149.86,74.93 149.86,40.64 146.05,36.83 146.05,11.43 142.24,7.62 130.81,7.62 IN-SUPPLY.7 IN-SUPPLY.6 121.92,19.05 C1.2 121.92,21.59 121.92,27.94 C5.- R42.2 138.43,36.83 146.05,44.45 146.05,71.12 C21.2 140.97,76.2 R47.1 | C11.- 83.82,36.83 83.82,29.21 C12.- 76.2,19.05 76.2,16.51 74.93,15.24 52.07,15.24 | OUT-SUPPLY.6 OUT-SUPPLY.7 48.26,7.62 49.53,7.62 52.07,10.16 52.07,15.24 | JP2.3 55.88,30.48 | 55.88,30.48 R2.1 50.8,33.02 50.8,78.74 66.04,93.98 77.47,93.98 | 55.88,24.13 54.61,24.13 53.34,22.86 TP4.TP 53.34,21.59 52.07,20.32 52.07,15.24 | 55.88,24.13 JP1.3 | 55.88,24.13 55.88,30.48 | R17.2 R12.2 72.39,78.74 C13.1 72.39,88.9 77.47,93.98 | 124.46,83.82 OUT-ANA.6 114.3,93.98 77.47,93.98 | R33.1 R35.1 105.41,53.34 107.95,50.8 107.95,43.18 111.76,39.37 114.3,39.37 115.57,40.64 115.57,43.18 JP4.3
  Bottom 0.813: C12.- R5.1 R5.2 | 124.46,83.82 128.91,79.38 v128.91,76.2 | v137.16,76.2 140.97,76.2
N$1
  Bottom 0.711: R1.2 R1.1 R2.2
N$2
  Bottom 0.711: IC1.2 63.5,22.86 JP1.2
N$3
  Bottom 0.711: R6.2 R6.1 58.42,46.99 R7.2
N$4
  Bottom 0.711: 66.04,36.83 73.66,36.83 TP1.TP 73.66,38.1 C11.+ | 66.04,36.83 R3.1 | IC2.3 66.04,50.8 66.04,36.83
N$5
  Bottom 0.711: 58.42,53.34 58.42,54.61 R8.2 | 58.42,53.34 R6.3 58.42,52.07 | IC2.2 66.04,53.34 58.42,53.34
N$6
  Bottom 0.711: 57.15,64.77 IC2.1 | R8.1 57.15,64.77 | R10.2 63.5,74.93 57.15,68.58 57.15,64.77
N$7
  Bottom 0.711: R3.2 57.15,33.02 JP2.2
N$8
  Bottom 0.711: R1.3 58.42,34.29 JP2.1 62.23,29.21 JP1.1
N$9
  Bottom 0.711: R4.1 74.93,22.86 C12.+ 82.55,30.48 | IC2.5 73.66,58.42 72.39,57.15 72.39,54.61 67.31,49.53 67.31,44.45 71.12,40.64 81.28,40.64 82.55,39.37 82.55,30.48 | 82.55,30.48 TP2.TP
  Bottom 0.813: R5.3 80.01,17.78 81.28,16.51 85.09,16.51 87.63,19.05 87.63,39.37 86.36,40.64 81.28,40.64
N$10
  Bottom 0.711: R7.1 R9.2 IC2.6
N$11
  Bottom 0.711: R9.1 R11.2 IC2.7
N$12
  Bottom 0.711: IC2.10 76.2,69.85 77.47,71.12 R10.1 R12.1
N$13
  Bottom 0.711: IC2.9 81.28,60.96 83.82,60.96 R11.1 R13.2
N$14
  Bottom 0.711: R14.2 TP3.TP 82.55,69.85 | IC2.8 81.28,68.58 82.55,69.85 | R13.1 82.55,69.85
N$15  (via drill 0.9 pad 0.81)
  Top 0.813: v10.16,43.18 v32.38,43.18
  Bottom 0.711: 6.35,43.18 R18.1
  Bottom 0.813: R19.2 6.35,43.18 v10.16,43.18 | v32.38,43.18 33.02,43.81 IC3.5
N$16
  Bottom 0.711: 67.31,88.9 C14.1 | R14.1 67.31,88.9 | 67.31,88.9 R15.2
N$17
  Bottom 0.711: IC2.12 71.12,71.12 74.93,74.93 C13.2 74.93,86.36 R15.1
N$18
  Bottom 0.711: R17.1 62.23,71.12 R16.2 62.23,69.85 IC2.13
N$19
  Bottom 0.711: JP3.1 13.97,54.61 R20.1 12.7,52.07 5.08,52.07 5.08,54.61 6.35,55.88 PH1.1 6.35,59.69
N$20
  Bottom 0.711: R22.3 30.48,33.02 R21.1
N$21
  Bottom 0.711: R22.2 R22.1 R24.2 35.56,43.18 IC3.6
N$22
  Bottom 0.711: R26.2 41.91,46.99 | 41.91,46.99 R24.1 | 41.91,46.99 IC3.7
N$23
  Bottom 0.711: R25.2 10.16,68.58 3.81,62.23 3.81,50.8 17.78,50.8 | IC3.1 17.78,50.8 | 17.78,50.8 R23.1
N$24
  Bottom 0.711: R21.2 22.86,38.1 R23.2 IC3.2
N$25
  Bottom 0.711: R25.1 R27.1 13.97,91.44 36.83,91.44 39.37,88.9 39.37,73.66
  Bottom 0.813: IC3.10 33.97,59.37 33.97,60.96 39.37,66.36 39.37,73.66
N$26
  Bottom 0.711: IC3.9 38.1,55.88 43.18,55.88 R26.1 R28.2
N$27
  Bottom 0.711: IC3.8 38.1,62.23 R28.1 R29.2
N$28
  Bottom 0.813: C17.1 R30.1 27.62,72.07 27.62,62.87 27.94,62.55 IC3.12
N$29
  Bottom 0.711: IC3.13 25.4,60.96 21.59,64.77 21.59,81.28 R32.2 R31.1
N$30
  Bottom 0.711: R29.1 C18.1
  Bottom 0.813: R30.2 R29.1
N$31
  Bottom 0.711: IC3.3 24.13,54.61 19.05,54.61 JP3.2
N$32
  Bottom 0.711: IC4.10 130.81,63.5 135.89,63.5 | R45.2 135.89,63.5 | C21.1 144.78,69.85 144.78,63.5 135.89,63.5
N$33
  Bottom 0.711: IC4.9 R46.1 R47.2
N$34
  Bottom 0.711: R45.1 138.43,57.15 | 138.43,57.15 R44.2 | 138.43,57.15 C22.1
N$35
  Bottom 0.711: R33.2 NTC.1 105.41,73.66 107.95,76.2 109.22,74.93 109.22,64.77 110.49,63.5 120.65,63.5 IC4.12
N$36
  Bottom 0.711: R36.1 R37.3
N$37
  Bottom 0.711: R36.2 R38.1 104.14,46.99 104.14,59.69 105.41,60.96 118.11,60.96 IC4.2
N$38
  Bottom 0.711: R38.2 113.03,43.18 | 113.03,43.18 R40.1 | IC4.1 118.11,48.26 113.03,43.18
N$39
  Bottom 0.711: R37.2 R37.1 97.79,68.58 106.68,77.47 116.84,77.47 R39.2 120.65,73.66 IC4.13
N$40
  Bottom 0.711: IC4.14 R41.1 R39.1
N$41  (via drill 0.9 pad 0.81)
  Top 0.813: v130.81,55.88 v110.49,55.88
  Bottom 0.711: R43.2 133.35,52.07 130.81,54.61 v130.81,55.88 IC4.6
  Bottom 0.813: R41.2 v110.49,55.88
N$42
  Bottom 0.711: R42.1 R40.2 129.54,50.8
  Bottom 0.813: IC4.5 128.27,55.88 129.54,54.61 129.54,50.8
N$43
  Bottom 0.711: R44.1 138.43,49.53 R43.1 IC4.7
N$44
  Bottom 0.711: R35.2 R34.1 JP4.1
N$45
  Bottom 0.813: IC4.3 119.38,54.61 JP4.2